# Altium schematic sheet cat-badge.SchDoc
size 297 x 209 mm; Address1: Address1; Address2: Address2; Address3: Address3; Address4: Address4; SheetNumber: 1; Scale: 1:1; Обозначение документа: АБВГ.123456.001Э3
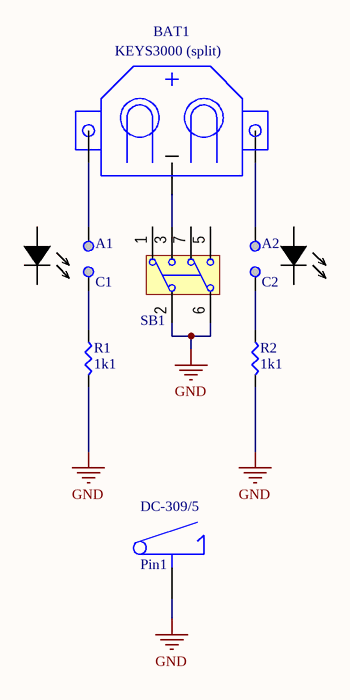
[diagram p0: cat-badge.SchDoc]

## Parts
A1  Test Point  [TP_1.2MM]  (value not drawn)  (no BOM)
A2  Test Point  [TP_1.2MM]  (value not drawn)  (no BOM)
BAT1  KEYS3000 (split)  [KEYS3000_split]
C1  Test Point  [TP_1.2MM]  (value not drawn)  (no BOM)
C2  Test Point  [TP_1.2MM]  (value not drawn)  (no BOM)
Pin1  DC-309/5  [DC-309/5]
R1  1k1  [RES0603]
R2  1k1  [RES0603]
SB1  JS202011JCQN  [JS202011JCQN]  (value not drawn)

## Nets
GND: Pin1.1 R1.1 R2.1 SB1.2 SB1.6
NetA1_1: A1.1 BAT1.3
NetA2_1: A2.1 BAT1.1
NetBAT1_2: BAT1.2 SB1.3
NetC1_1: C1.1 R1.2
NetC2_1: C2.1 R2.2

Not connected (* = marked no-connect by the designer): SB1 1 5 7

## Notes on the sheet
- Подп. и дата
- Инв. № дубл.
- Взам. инв. №
- Инв. № подл.
- Изм.
- Лист
- № докум.
- Подп.
- Дата
- Копировал
- Формат А4

## Library data of the parts
A1 A2 C1 C2 = TP/R1.2: Item: TP1.2; Part Number: TP/R1.2; Category: Test Point
BAT1 = KEYS3000 (split): Coin Cell Battery Holders SMT HOLDER FOR CR1220; Manufacturer: KEYSTONE; Item: 1220 battery holder split shield; Part Number: KEYS3000 (split); Supplier 1: BelChip; Supplier Part Number 1: 48852; Case: BH611220-P; HelpURL: https://static.chipdip.ru/lib/181/DOC014181351.pdf; Category: Coin Cell Battery Holders
Pin1 = DC-309/5: Bar pin 20mm; Manufacturer: none; Item: Bar-pin 20mm; Part Number: DC-309/5; Supplier 1: none; Supplier Part Number 1: none; Case: none; HelpURL: none; Category: Mechanical
R1 R2 = ERJ-3EKF1101V: Tolerance ±1% / Power (Watts) 0.1W, 1/10W / Temperature Coefficient ±100ppm/°C; Manufacturer: Panasonic; Item: 1k1  ±1% 0.1W; Part Number: ERJ-3EKF1101V; Supplier 1: Mouser; Supplier Part Number 1: 667-ERJ-3EKF1101V; Case: 0603; Tolerance: 1%; Value: 1k1; HelpURL: https://eu.mouser.com/datasheet/2/315/AOA0000C304-1149620.pdf; Category: Thin Film Resistors - SMD
SB1 = JS202011JCQN: Slide Switches DPDT .3A; Manufacturer: C&K Switches; Switch Function: ON  - ON; Vdss: 6V; Part Number: JS202011JCQN; Item: JS202011JCQN; Supplier: Chip-Dip; Mechanical Life: N/A; Case: SMD/SMT; HelpURL: https://www.ckswitches.com/media/1422/js.pdf; Category: Slide Switches